# Altium schematic sheet Memory.SchDoc
size A4; SheetNumber: 6; SheetTotal: 7
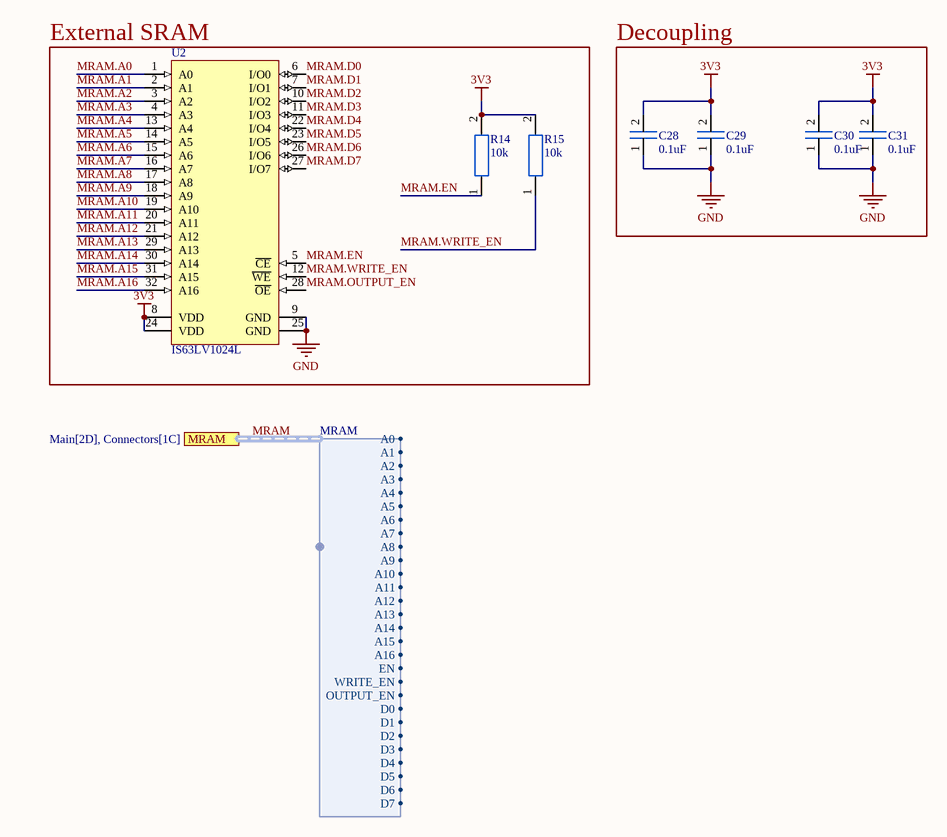
[diagram p0: Memory.SchDoc]

## Parts
C28  0.1uF  [0402_footprint]
C29  0.1uF  [0402_footprint]
C30  0.1uF  [0402_footprint]
C31  0.1uF  [0402_footprint]
R14  10k  [0402_footprint]
R15  10k  [0402_footprint]
U2  IS63LV1024L  [ISSI-TSOP-2-32_N]

## Blocks framed on the sheet
External SRAM: R14 R15 U2
Decoupling: C28-C31

## Ports
MRAM (harness MRAM, see Main[2D], Connectors[1C])

## Harnesses
MRAM: A0, A1, A2, A3, A4, A5, A6, A7, A8, A9, A10, A11, A12, A13, A14, A15, A16, EN, WRITE_EN, OUTPUT_EN, D0, D1, D2, D3, D4, D5, D6, D7

## Nets
3V3: C28.2 C29.2 C30.2 C31.2 R14.2 R15.2 U2.8(VDD) U2.24(VDD)
GND: C28.1 C29.1 C30.1 C31.1 U2.9(GND) U2.25(GND)
MRAM.A0: U2.1(A0)
MRAM.A1: U2.2(A1)
MRAM.A2: U2.3(A2)
MRAM.A3: U2.4(A3)
MRAM.A4: U2.13(A4)
MRAM.A5: U2.14(A5)
MRAM.A6: U2.15(A6)
MRAM.A7: U2.16(A7)
MRAM.A8: U2.17(A8)
MRAM.A9: U2.18(A9)
MRAM.A10: U2.19(A10)
MRAM.A11: U2.20(A11)
MRAM.A12: U2.21(A12)
MRAM.A13: U2.29(A13)
MRAM.A14: U2.30(A14)
MRAM.A15: U2.31(A15)
MRAM.A16: U2.32(A16)
MRAM.D0: U2.6(I/O0)
MRAM.D1: U2.7(I/O1)
MRAM.D2: U2.10(I/O2)
MRAM.D3: U2.11(I/O3)
MRAM.D4: U2.22(I/O4)
MRAM.D5: U2.23(I/O5)
MRAM.D6: U2.26(I/O6)
MRAM.D7: U2.27(I/O7)
MRAM.EN: R14.1 U2.5(~{CE})
MRAM.OUTPUT_EN: U2.28(~{OE})
MRAM.WRITE_EN: R15.1 U2.12(~{WE})

## Buses and harness runs
harness MRAM = port MRAM

## Library data of the parts
C28-C31 = Capacitor_0402: 0402 capacitor
R14 R15 = Resistor_0402
U2 = CMP-0513-00267-1: 1 M High Speed Asynchronous CMOS SRAM with ECC, 128 K x 8, -40 to 85 degC, 32-Pin SOP (TSOP-2-32), Pb-Free; Manufacturer: Integrated Silicon Solution Inc (ISSI); PartNumber: IS61WV1288EEBLL-10TLI; Speed (ns): 10; Packing: Tray / Tube; Density: 1M; Organization: 128K x 8; ComponentLink2URL: https://www.mouser.lt/datasheet/2/198/63LV1024_L-258513.pdf; Mounting Technology: Surface Mount; PackageReference: TSOP-2-32; ComponentLink1Description: Buy; DatasheetVersion: Rev. A; ComponentLink1URL: https://www.mouser.lt/ProductDetail/ISSI/IS63LV1024L-10TLI?qs=sGAEpiMZZMtm4RFapVkzrE09Sz2U0bpYMMQofUUKL3Q%3D; RoHS: Pb-Free; ComponentLink2Description: Datasheet; PackageDescription: 32-Pin 400 mil TSOP-2, Body 20.95 x 10.16 mm, Pitch 1.27 mm; PackageVersion: Rev. E, 06/2009